# Altium schematic sheet input_signal_conditioning.SchDoc
size A4; SheetNumber: 3; SheetTotal: 6
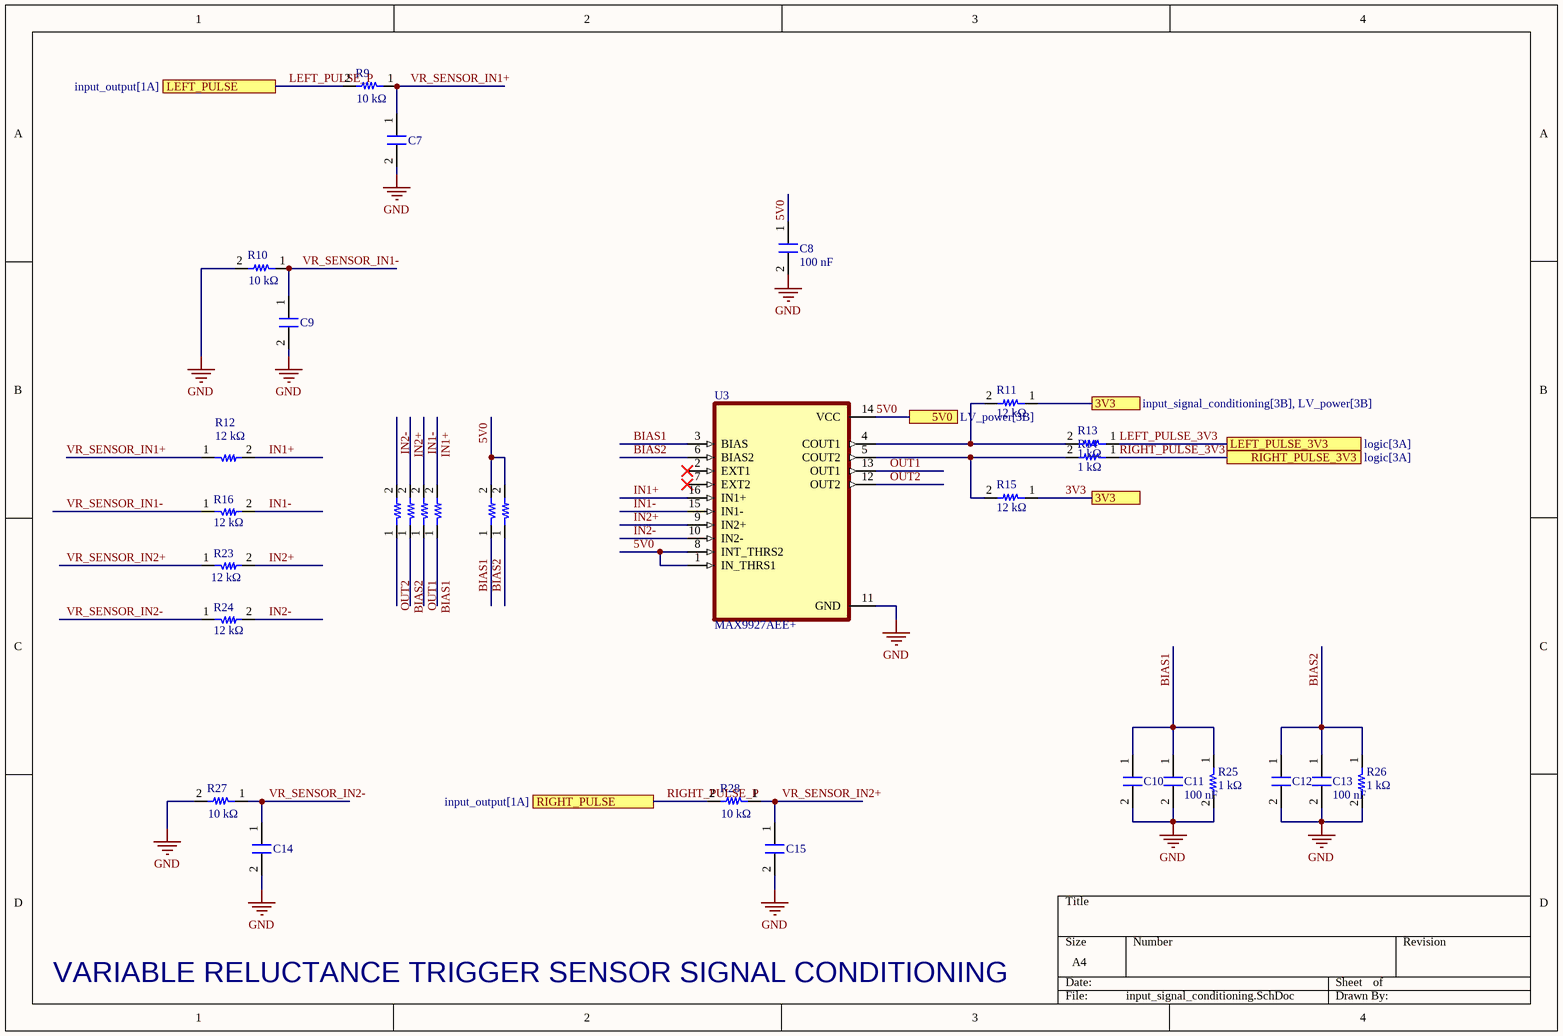
[diagram p0: input_signal_conditioning.SchDoc]

## Parts
C7  Capacitor_0402  [0402_fp]  (value not drawn)
C8  value 100 nF  [0402_fp]  (hidden comment: Capacitor_0402)
C9  Capacitor_0402  [0402_fp]  (value not drawn)
C10  Capacitor_0603  [0603_FP]  (value not drawn)
C11  value 100 nF  [0402_fp]  (hidden comment: Capacitor_0402)
C12  Capacitor_0603  [0603_FP]  (value not drawn)
C13  value 100 nF  [0402_fp]  (hidden comment: Capacitor_0402)
C14  Capacitor_0402  [0402_fp]  (value not drawn)
C15  Capacitor_0402  [0402_fp]  (value not drawn)
R9  value 10 kΩ  [0402_fp]  (hidden comment: Resistor_0402)
R10  value 10 kΩ  [0402_fp]  (hidden comment: Resistor_0402)
R11  value 12 kΩ  [0402_fp]  (hidden comment: Resistor_0402)
R12  value 12 kΩ  [0402_fp]  (hidden comment: Resistor_0402)
R13  value 1 kΩ  [0402_fp]  (hidden comment: Resistor_0402)
R14  value 1 kΩ  [0402_fp]  (hidden comment: Resistor_0402)
R15  value 12 kΩ  [0402_fp]  (hidden comment: Resistor_0402)
R16  value 12 kΩ  [0402_fp]  (hidden comment: Resistor_0402)
R17  Resistor_0402  [0402_fp]  (value not drawn)
R18  Resistor_0402  [0402_fp]  (value not drawn)
R19  Resistor_0402  [0402_fp]  (value not drawn)
R20  Resistor_0402  [0402_fp]  (value not drawn)
R21  Resistor_0402  [0402_fp]  (value not drawn)
R22  Resistor_0402  [0402_fp]  (value not drawn)
R23  value 12 kΩ  [0402_fp]  (hidden comment: Resistor_0402)
R24  value 12 kΩ  [0402_fp]  (hidden comment: Resistor_0402)
R25  value 1 kΩ  [0402_fp]  (hidden comment: Resistor_0402)
R26  value 1 kΩ  [0402_fp]  (hidden comment: Resistor_0402)
R27  value 10 kΩ  [0402_fp]  (hidden comment: Resistor_0402)
R28  value 10 kΩ  [0402_fp]  (hidden comment: Resistor_0402)
U3  MAX9927AEE+  [SOP63P602X175-16N]

## Ports
3V3 (see input_signal_conditioning[3B], LV_power[3B]), 5V0 (see LV_power[3B]), LEFT_PULSE (see input_output[1A]), LEFT_PULSE_3V3 (see logic[3A]), RIGHT_PULSE (see input_output[1A]), RIGHT_PULSE_3V3 (see logic[3A])

## Nets
GND: C7.2 C8.2 C9.2 C10.2 C11.2 C12.2 C13.2 C14.2 C15.2 R10.2 R25.2 R26.2 R27.2 U3.11(GND)
3V3: R11.1 R15.1 ; port 3V3
5V0: C8.1 R21.2 R22.2 U3.1(IN_THRS1) U3.8(INT_THRS2) U3.14(VCC) ; port 5V0
BIAS1: C10.1 C11.1 R20.1 R21.1 R25.1 U3.3(BIAS)
BIAS2: C12.1 C13.1 R18.1 R22.1 R26.1 U3.6(BIAS2)
IN1+: R12.2 R20.2 U3.16(IN1+)
IN1-: R16.2 R19.2 U3.15(IN1-)
IN2+: R18.2 R23.2 U3.9(IN2+)
IN2-: R17.2 R24.2 U3.10(IN2-)
LEFT_PULSE_3V3: R13.1 ; port LEFT_PULSE_3V3
LEFT_PULSE_P: R9.2 ; port LEFT_PULSE
OUT1: R19.1 U3.13(OUT1)
OUT2: R17.1 U3.12(OUT2)
RIGHT_PULSE_3V3: R14.1 ; port RIGHT_PULSE_3V3
RIGHT_PULSE_P: R28.2 ; port RIGHT_PULSE
VR_SENSOR_IN1+: C7.1 R9.1 R12.1
VR_SENSOR_IN1-: C9.1 R10.1 R16.1
VR_SENSOR_IN2+: C15.1 R23.1 R28.1
VR_SENSOR_IN2-: C14.1 R24.1 R27.1
NetR11_2: R11.2 R13.2 U3.4(COUT1)
NetR14_2: R14.2 R15.2 U3.5(COUT2)

Not connected (* = marked no-connect by the designer): U3 2(EXT1)* 7(EXT2)*

## Notes on the sheet
- VARIABLE RELUCTANCE TRIGGER SENSOR SIGNAL CONDITIONING

## Library data of the parts
C7 C9 C14 C15 = Capacitor_0402: Value: 1 nF; Format: 0402; Package: 0402
C8 C11 C13 = Capacitor_0402: Format: 0402; Package: 0402
C10 C12 = Capacitor_0603: Value: 10 uF; Format: 0402; Package: 0402
R9-R16 R23-R28 = Resistor_0402: Format: 0402; Package: 0402
R17-R20 = Resistor_0402: Value: 12 kΩ; Format: 0402; Package: 0402
R21 R22 = Resistor_0402: Value: 1 kΩ; Format: 0402; Package: 0402
U3 = MAX9927AEE+: Variable-Reluctance Sensor Interface with Differential Input and Adaptive Peak Threshold; MF: Analog Devices; SnapEDA_Link: https://www.snapeda.com/parts/MAX9927AEE+/Analog+Devices/view-part/?ref=snap; Package: QSOP-16 Maxim; Value: *; MP: MAX9927AEE+; Check_prices: https://www.snapeda.com/parts/MAX9927AEE+/Analog+Devices/view-part/?ref=eda